# Altium schematic sheet 1_P1.schdoc.schdoc
size 431 x 309 mm; Symbol: Sheet-Symbol_A4; Device: Sheet-Symbol_A4; @Page Name: P1; @Create Date: 2023-09-14; @Page Count: 1; @Page No: 1; @Project Name: iFOC-Demo; @Schematic Name: Schematic1; @Update Date: 2023-09-19; Company: Matrixchung; Page Size: A4; Version: V1.0
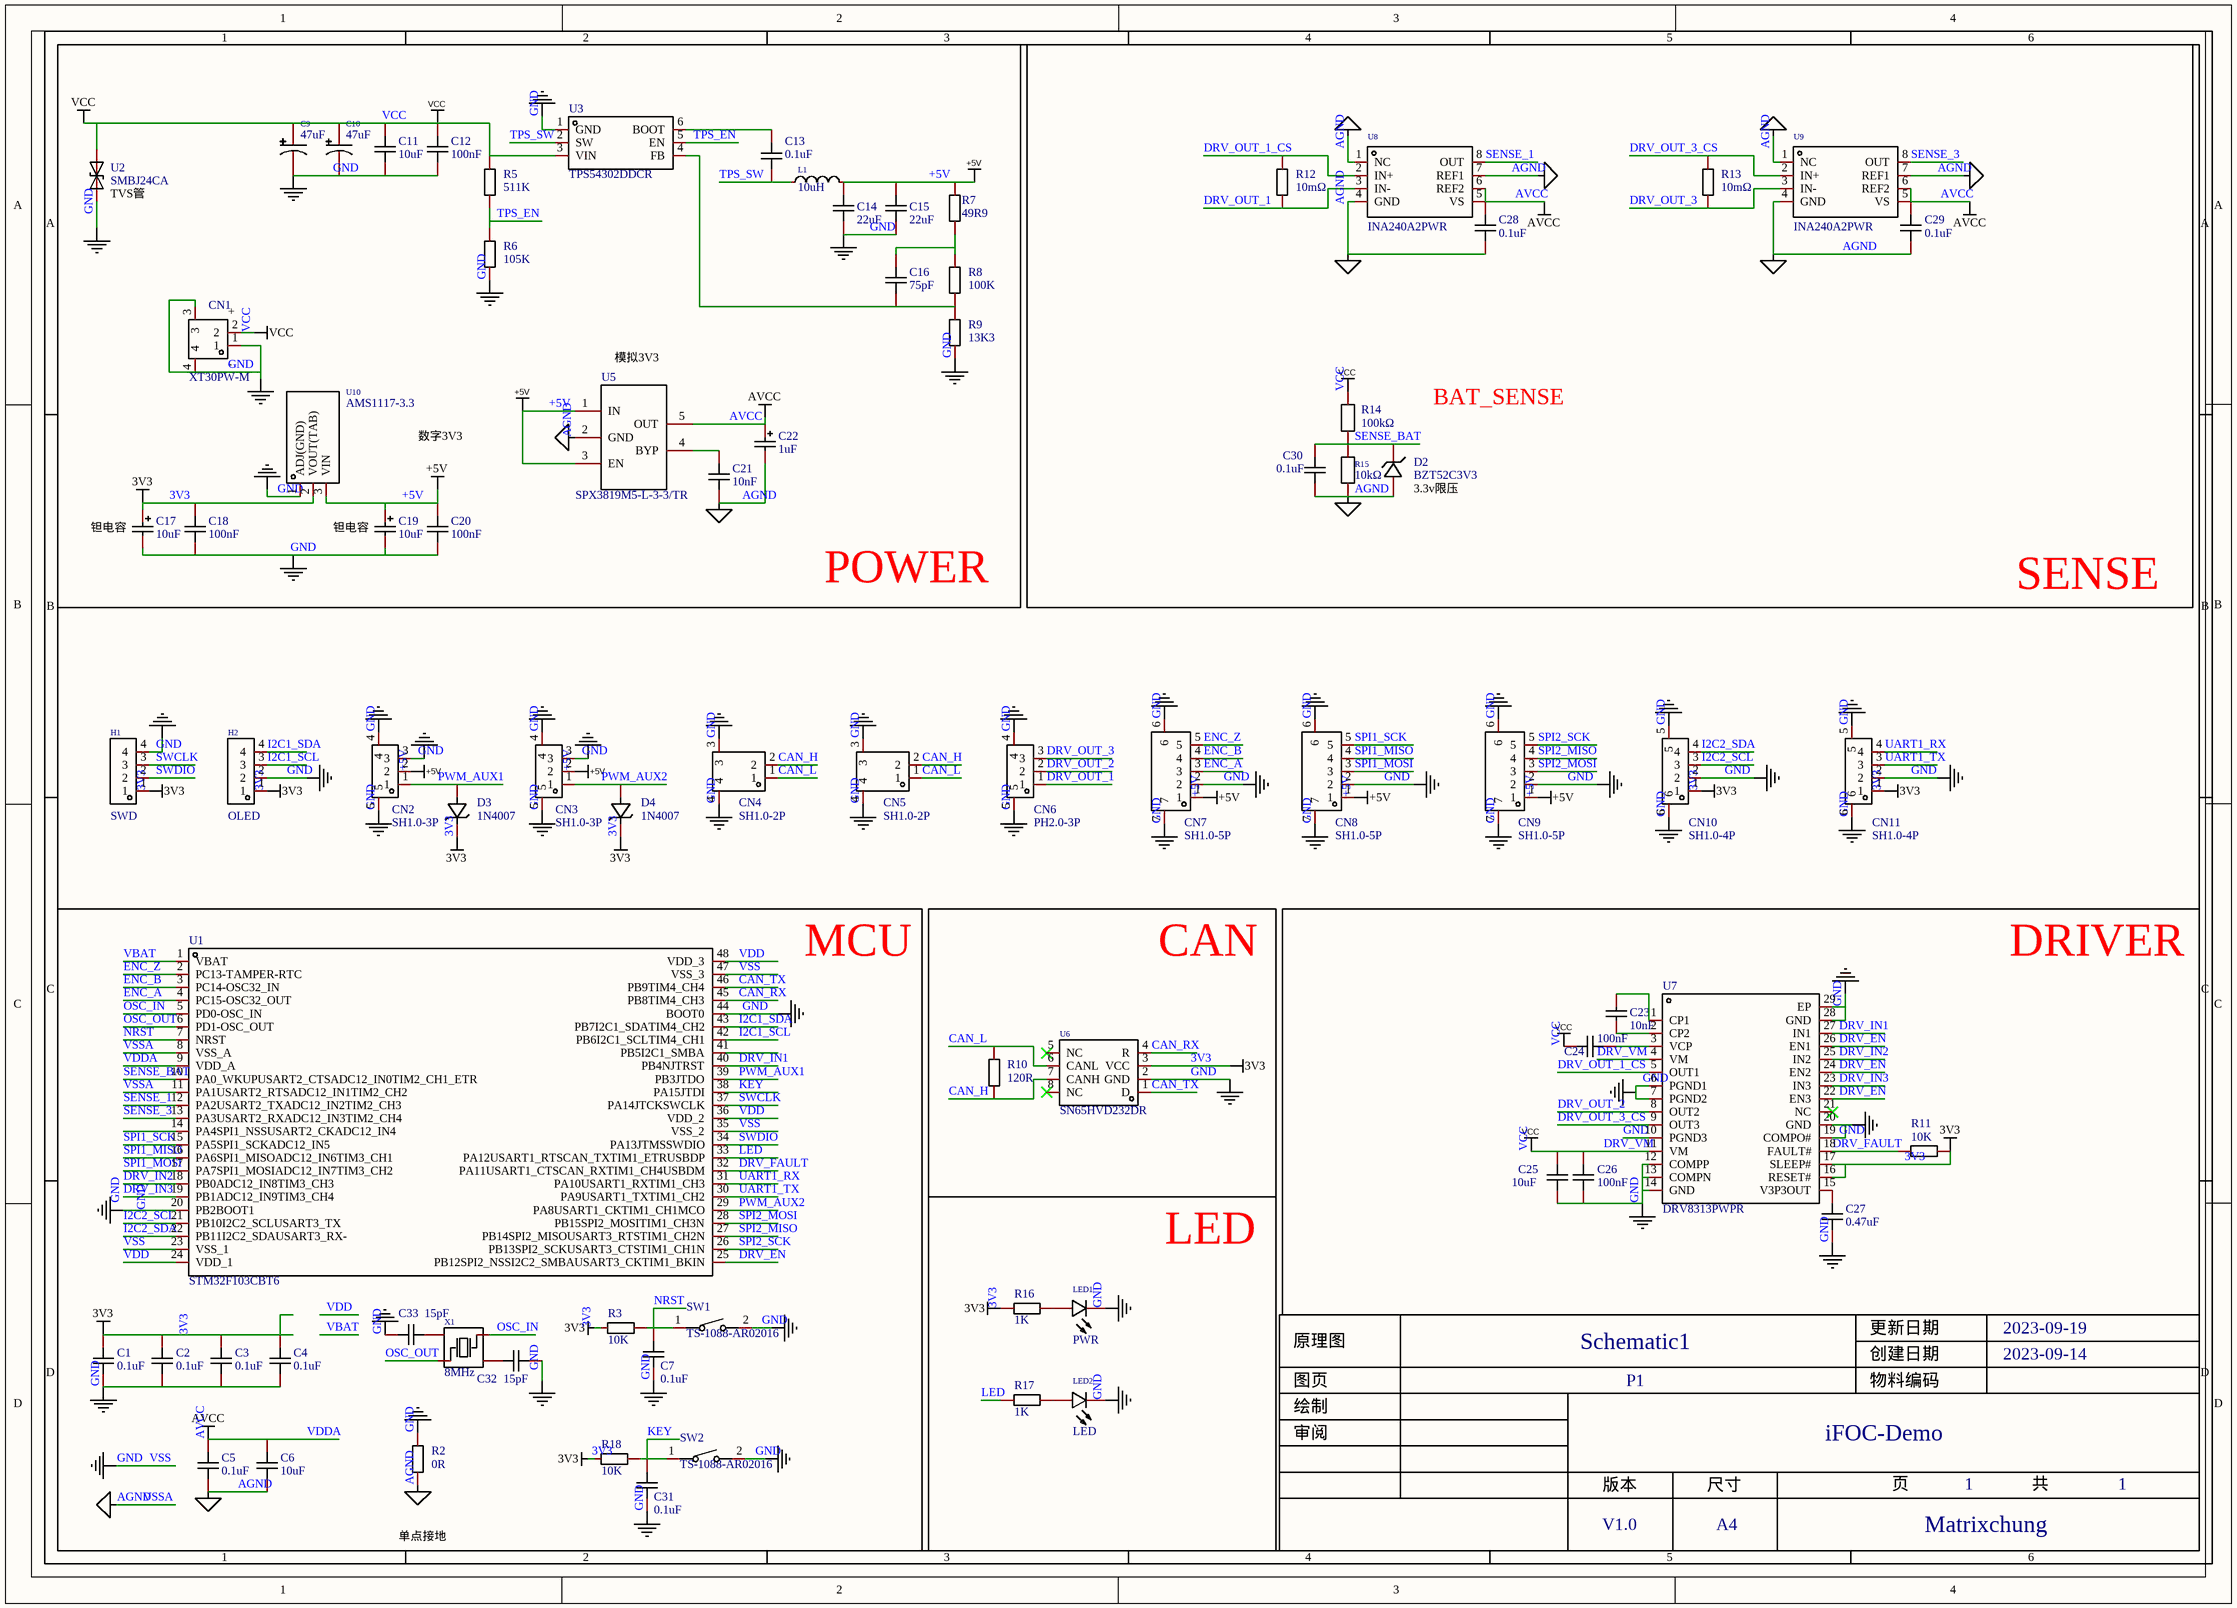
[diagram p0: 1_P1.schdoc.schdoc]

## Parts
C1  0.1uF  [C0603]
C2  0.1uF  [C0603]
C3  0.1uF  [C0603]
C4  0.1uF  [C0603]
C5  0.1uF  [C0603]
C6  10uF  [C0603]
C7  0.1uF  [C0603]
C9  47uF  [CAP-SMD_BD6.3-L6.6-W6.6-LS7.6-FD]
C10  47uF  [CAP-SMD_BD6.3-L6.6-W6.6-LS7.6-FD]
C11  10uF  [C0603]
C12  100nF  [C0603]
C13  0.1uF  [C0603]
C14  22uF  [C0603]
C15  22uF  [C0603]
C16  75pF  [C0603]
C17  10uF  [CASE-A_3216]
C18  100nF  [C0603]
C19  10uF  [CASE-A_3216]
C20  100nF  [C0603]
C21  10nF  [C0603]
C22  1uF  [CASE-A_3216]
C23  10nF  [C0603]
C24  100nF  [C0603]
C25  10uF  [C0603]
C26  100nF  [C0603]
C27  0.47uF  [C0603]
C28  0.1uF  [C0603]
C29  0.1uF  [C0603]
C30  0.1uF  [C0603]
C31  0.1uF  [C0603]
C32  15pF  [C0603]
C33  15pF  [C0603]
CN1  XT30PW-M  [CONN-TH_XT30PW-M]
CN2  SH1.0-3P  [CONN-SMD_3P-P1.00_HDGC_HDGC1002WR-S-3P]
CN3  SH1.0-3P  [CONN-SMD_3P-P1.00_HDGC_HDGC1002WR-S-3P]
CN4  SH1.0-2P  [CONN-SMD_A1002WR-S-2P]
CN5  SH1.0-2P  [CONN-SMD_A1002WR-S-2P]
CN6  PH2.0-3P  [CONN-SMD_3P-P2.00_ZX-PH2.0-WT3P]
CN7  SH1.0-5P  [CONN-SMD_5P-P1.00_SHOU-HAN_1.0-5P-WT]
CN8  SH1.0-5P  [CONN-SMD_5P-P1.00_SHOU-HAN_1.0-5P-WT]
CN9  SH1.0-5P  [CONN-SMD_5P-P1.00_SHOU-HAN_1.0-5P-WT]
CN10  SH1.0-4P  [CONN-SMD_4P-P1.00_HDGC_HDGC1002WR-S-4P]
CN11  SH1.0-4P  [CONN-SMD_4P-P1.00_HDGC_HDGC1002WR-S-4P]
D2  BZT52C3V3  [SOD-123_L2.7-W1.6-LS3.7-RD]
D3  1N4007  [SOD-123FL_L2.7-W1.8-LS3.8-RD]
D4  1N4007  [SOD-123FL_L2.7-W1.8-LS3.8-RD]
H1  SWD  [HDR-TH_4P-P2.54-V-F]
H2  OLED  [HDR-TH_4P-P2.54-V-F]
L1  10uH  [IND-SMD_L5.4-W5.2_FXL0530]
LED1  PWR  [LED0603-RD]
LED2  LED  [LED0603-RD_RED]
R2  0R  [R0603]
R3  10K  [R0603]
R5  511K  [R0603]
R6  105K  [R0603]
R7  49R9  [R0603]
R8  100K  [R0603]
R9  13K3  [R0603]
R10  120R  [R0603]
R11  10K  [R0603]
R12  10mΩ  [R0805]
R13  10mΩ  [R0805]
R14  100kΩ  [R0805]
R15  10kΩ  [R0603]
R16  1K  [R0603]
R17  1K  [R0603]
R18  10K  [R0603]
SW1  TS-1088-AR02016  [SW-SMD_L3.9-W3.0-P4.45]
SW2  TS-1088-AR02016  [SW-SMD_L3.9-W3.0-P4.45]
U1  STM32F103CBT6  [LQFP-48_L7.0-W7.0-P0.50-LS9.0-BL]
U2  SMBJ24CA  [SMB_L4.3-W3.6-LS5.4-BI]
U3  TPS54302DDCR  [SOT-23-6_L2.9-W1.6-P0.95-LS2.8-BL]
U5  SPX3819M5-L-3-3/TR  [SOT-23-5_L3.0-W1.7-P0.95-LS2.8-BL]
U6  SN65HVD232DR  [SOIC-8_L5.0-W4.0-P1.27-LS6.0-BL]
U7  DRV8313PWPR  [HTSSOP-28_L9.8-W4.5-P0.65-LS6.6-BL-EP]
U8  INA240A2PWR  [TSSOP-8_L4.4-W3.0-P0.65-LS6.4-BL]
U9  INA240A2PWR  [TSSOP-8_L4.4-W3.0-P0.65-LS6.4-BL]
U10  AMS1117-3.3  [SOT-89_L4.5-W2.5-P1.50-LS4.2-BR]
X1  8MHz  [OSC-SMD_4P-L3.2-W2.5-BL]

## Blocks framed on the sheet
POWER: C9-C22 CN1 L1 R5-R9 U2 U3 U5 U10
SENSE: C28-C30 D2 R12-R15 U8 U9
MCU: C1-C7 C31-C33 R2 R3 R18 SW1 SW2 U1 X1
CAN: R10 U6
DRIVER: C23-C27 R11 U7
LED: LED1 LED2 R16 R17

## Nets
3V3: C1.2 C2.2 C3.2 C4.2 C17.1 C18.2 CN10.1 CN11.1 D3.1(K) D4.1(K) H1.1 H2.1 R3.1 R11.2 R16.1 R18.1 U6.3(VCC) U7.16(RESET#) U7.17(SLEEP#) U10.2(VOUT(TAB))
+5V: C14.2 C15.2 C19.1 C20.2 CN2.2 CN3.2 CN7.1 CN8.1 CN9.1 L1.2 R7.2 U5.1(IN) U5.3(EN) U10.3(VIN)
AGND: C1.1 C2.1 C3.1 C4.1 C5.1 C6.1 C7.1 C9.2 C10.2 C11.1 C12.1 C14.1 C15.1 C17.2 C18.1 C19.2 C20.1 C21.1 C22.2 C25.1 C26.1 C27.1 C28.1 C29.1 C30.1 C31.1 C32.2 C33.1 CN1.1 CN1.3 CN1.4 CN2.3 CN2.4 CN2.5 CN3.3 CN3.4 CN3.5 CN4.3 CN4.4 CN5.3 CN5.4 CN6.4 CN6.5 CN7.2 CN7.6 CN7.7 CN8.2 CN8.6 CN8.7 CN9.2 CN9.6 CN9.7 CN10.2 CN10.5 CN10.6 CN11.2 CN11.5 CN11.6 D2.2(A) H1.4 H2.2 LED1.1(-) LED2.1(K) R2.1 R2.2 R6.1 R9.1 R15.1 SW1.2 SW2.2 U1.8(VSS_A) U1.11(PA1USART2_RTSADC12_IN1TIM2_CH2) U1.20(PB2BOOT1) U1.23(VSS_1) U1.35(VSS_2) U1.44(BOOT0) U1.47(VSS_3) U2.2(A) U3.1(GND) U5.2(GND) U6.2(GND) U7.6(PGND1) U7.7(PGND2) U7.10(PGND3) U7.12(COMPP) U7.13(COMPN) U7.14(GND) U7.19(COMPO#) U7.20(GND) U7.28(GND) U7.29(EP) U8.1(NC) U8.4(GND) U8.7(REF1) U9.1(NC) U9.4(GND) U9.7(REF1) U10.1(ADJ(GND))  [also labelled GND, VSS, VSSA]
AVCC: C5.2 C6.2 C22.1 C28.2 C29.2 U1.9(VDD_A) U5.5(OUT) U8.5(VS) U8.6(REF2) U9.5(VS) U9.6(REF2)  [also labelled VDDA]
DRV_VM: C9.1 C10.1 C11.2 C12.2 C24.1 C25.2 C26.2 CN1.2 R5.2 R14.2 U2.1(K) U3.3(VIN) U7.4(VM) U7.11(VM)  [also labelled VCC]
CAN_H: CN4.2 CN5.2 R10.1 U6.7(CANH)
CAN_L: CN4.1 CN5.1 R10.2 U6.6(CANL)
CAN_RX: U1.45(PB8TIM4_CH3) U6.4(R)
CAN_TX: U1.46(PB9TIM4_CH4) U6.1(D)
DRV_EN: U1.25(PB12SPI2_NSSI2C2_SMBAUSART3_CKTIM1_BKIN) U7.22(EN3) U7.24(EN2) U7.26(EN1)
DRV_FAULT: R11.1 U1.32(PA11USART1_CTSCAN_RXTIM1_CH4USBDM) U7.18(FAULT#)
DRV_IN1: U1.40(PB4NJTRST) U7.27(IN1)
DRV_IN2: U1.18(PB0ADC12_IN8TIM3_CH3) U7.25(IN2)
DRV_IN3: U1.19(PB1ADC12_IN9TIM3_CH4) U7.23(IN3)
DRV_OUT_1: CN6.1 R12.1 U8.3(IN-)
DRV_OUT_1_CS: R12.2 U7.5(OUT1) U8.2(IN+)
DRV_OUT_2: CN6.2 U7.8(OUT2)
DRV_OUT_3: CN6.3 R13.1 U9.3(IN-)
DRV_OUT_3_CS: R13.2 U7.9(OUT3) U9.2(IN+)
ENC_A: CN7.3 U1.4(PC15-OSC32_OUT)
ENC_B: CN7.4 U1.3(PC14-OSC32_IN)
ENC_Z: CN7.5 U1.2(PC13-TAMPER-RTC)
I2C1_SCL: H2.3 U1.42(PB6I2C1_SCLTIM4_CH1)
I2C1_SDA: H2.4 U1.43(PB7I2C1_SDATIM4_CH2)
I2C2_SCL: CN10.3 U1.21(PB10I2C2_SCLUSART3_TX)
I2C2_SDA: CN10.4 U1.22(PB11I2C2_SDAUSART3_RX-)
KEY: C31.2 R18.2 SW2.1 U1.38(PA15JTDI)
LED: R17.1 U1.33(PA12USART1_RTSCAN_TXTIM1_ETRUSBDP)
NRST: C7.2 R3.2 SW1.1 U1.7(NRST)
OSC_IN: U1.5(PD0-OSC_IN) X1.3
OSC_OUT: U1.6(PD1-OSC_OUT) X1.1
PWM_AUX1: CN2.1 D3.2(A) U1.39(PB3JTDO)
PWM_AUX2: CN3.1 D4.2(A) U1.29(PA8USART1_CKTIM1_CH1MCO)
SENSE_1: U1.12(PA2USART2_TXADC12_IN2TIM2_CH3) U8.8(OUT)
SENSE_3: U1.13(PA3USART2_RXADC12_IN3TIM2_CH4) U9.8(OUT)
SENSE_BAT: C30.2 D2.1(K) R14.1 R15.2 U1.10(PA0_WKUPUSART2_CTSADC12_IN0TIM2_CH1_ETR)
SPI1_MISO: CN8.4 U1.16(PA6SPI1_MISOADC12_IN6TIM3_CH1)
SPI1_MOSI: CN8.3 U1.17(PA7SPI1_MOSIADC12_IN7TIM3_CH2)
SPI1_SCK: CN8.5 U1.15(PA5SPI1_SCKADC12_IN5)
SPI2_MISO: CN9.4 U1.27(PB14SPI2_MISOUSART3_RTSTIM1_CH2N)
SPI2_MOSI: CN9.3 U1.28(PB15SPI2_MOSITIM1_CH3N)
SPI2_SCK: CN9.5 U1.26(PB13SPI2_SCKUSART3_CTSTIM1_CH1N)
SWCLK: H1.3 U1.37(PA14JTCKSWCLK)
SWDIO: H1.2 U1.34(PA13JTMSSWDIO)
TPS_EN: R5.1 R6.2 U3.5(EN)
TPS_SW: C13.1 L1.1 U3.2(SW)
UART1_RX: CN11.4 U1.31(PA10USART1_RXTIM1_CH3)
UART1_TX: CN11.3 U1.30(PA9USART1_TXTIM1_CH2)
VBAT: U1.1(VBAT)
VDD: U1.24(VDD_1) U1.36(VDD_2) U1.48(VDD_3)
NetC13_2: C13.2 U3.6(BOOT)
NetC16_1: C16.1 R8.1 R9.2 U3.4(FB)
NetC16_2: C16.2 R7.1 R8.2
NetC21_2: C21.2 U5.4(BYP)
NetC23_1: C23.1 U7.2(CP2)
NetC23_2: C23.2 U7.1(CP1)
NetC24_2: C24.2 U7.3(VCP)
NetC27_2: C27.2 U7.15(V3P3OUT)
NetC32_1: C32.1 X1.2
NetC33_2: C33.2 X1.4
NetLED1_2: LED1.2(+) R16.2
NetLED2_2: LED2.2(A) R17.2

Not connected (* = marked no-connect by the designer): U1 14(PA4SPI1_NSSUSART2_CKADC12_IN4) 41(PB5I2C1_SMBA); U6 5(NC)* 8(NC)*; U7 21(NC)*

## Notes on the sheet
- (near U2) TVS管
- (near CN1) +
- (near CN1) -
- (near U5) 模拟3V3
- 数字3V3
- BAT_SENSE
- (near D2) 3.3v限压
- (near C17) 钽电容
- 钽电容
- 单点接地
- Labels drawn without touching a wire or pin: GND
- 1
- 2
- 3
- 4
- 5
- 6
- A
- B
- C
- D
- 原理图
- Schematic1
- 创建日期
- 更新日期
- 2023-09-14
- 2023-09-19
- 审阅
- 绘制
- 图页
- P1
- 物料编码
- iFOC-Demo
- 版本
- 尺寸
- 页
- 共
- V1.0
- A4
- Matrixchung

## Library data of the parts
C1-C7 C11-C16 C18 C20 C21 C24-C33 = CAP_0603: Symbol: CapAcitance; Convert to PCB: yes; Device: CAP_0603; Add into BOM: yes; Supplier Footprint: 0603
  C1-C5 C7 C13 C28-C31: Name: 0.1uF; Value: 0.1uF
  C6 C11 C25: Name: 10uF; Value: 10uF
  C12 C18 C20 C24 C26: Name: 100nF; Value: 100nF
  C14 C15: Name: 22uF; Value: 22uF
  C16: Name: 75pF; Value: 75pF
  C21: Name: 10nF; Value: 10nF
  C27: Name: 0.47uF; Value: 0.47uF
  C32 C33: Name: 15pF; Value: 15pF
C9 C10 = VT1V470M0605: 容值:47uF;精度:±20%;额定电压:35V;纹波电流:66mA@120Hz;等效串联电阻:-;; Manufacturer: ROQANG(容强); Add into BOM: yes; Tolerance: ±20%; Rated Voltage: 35V; φD: 6.3mm; L: 5.4mm; Lifetime @ Temp: 2000hrs@105℃; Name: 47uF; Symbol: VT1V470M0605; Device: VT1V470M0605; LCSC Part Name: 47uF ±20% 35V; Supplier Part: C90276; Manufacturer Part: VT1V470M0605; Supplier Footprint: SMD,D6.3xL5.4mm; JLCPCB Part Class: 扩展库; Datasheet: https://atta.szlcsc.com/upload/public/pdf/source/20161207/1481104186053.pdf; Supplier: LCSC; Convert to PCB: yes; Value: 47uF; Ripple Current: 66mA@120Hz; Equivalent Series Resistance(ESR): -; Operating Temperature: -40℃~+105℃
C17 C19 = TAJA106K010RNJ: 容值:10uF;精度:±10%;额定电压:10V;等效串联电阻:3Ω@100kHz;; Manufacturer: Kyocera AVX; Add into BOM: yes; Tolerance: ±10%; Rated Voltage: 10V; Name: 10uF; Symbol: TAJA106K010RNJ; Device: TAJA106K010RNJ; LCSC Part Name: 10uF ±10% 10V; Supplier Part: C7177; Manufacturer Part: TAJA106K010RNJ; Supplier Footprint: CASE-A-3216; JLCPCB Part Class: 扩展库; Datasheet: https://atta.szlcsc.com/upload/public/pdf/source/20160107/1457707748330.pdf; Supplier: LCSC; Convert to PCB: yes; Value: 10uF; Equivalent Series Resistance(ESR): 3Ω@100kHz; Operating Temperature: -55℃~+125℃
C22 = TAJA105K016RNJ: 容值:1uF;精度:±10%;额定电压:16V;等效串联电阻:11Ω;; Manufacturer: Kyocera AVX; Add into BOM: yes; Tolerance: ±10%; Rated Voltage: 16V; Equivalent Series Resistance(ESR): 11Ω; Name: 1uF; Symbol: TAJA105K016RNJ; Device: TAJA105K016RNJ; LCSC Part Name: 1uF ±10% 16V; Supplier Part: C7174; Manufacturer Part: TAJA105K016RNJ; Supplier Footprint: CASE-A-3216; JLCPCB Part Class: 扩展库; Datasheet: https://atta.szlcsc.com/upload/public/pdf/source/20160107/1457707748219.pdf; Supplier: LCSC; Convert to PCB: yes; Value: 1uF; Operating Temperature: -55℃~+125℃
C23 = 0603B103K101NT: 容值:10nF;精度:±10%;额定电压:100V;材质(温度系数):X7R;; Manufacturer: FH(风华); Add into BOM: yes; Tolerance: ±10%; Voltage Rated: 100V; Temperature Coefficient: X7R; Name: 10nF; Symbol: 0603B103K101NT; Device: 0603B103K101NT; LCSC Part Name: 10nF ±10% 100V; Supplier Part: C43253; Manufacturer Part: 0603B103K101NT; Supplier Footprint: 0603; JLCPCB Part Class: 扩展库; Datasheet: https://atta.szlcsc.com/upload/public/pdf/source/20170923/C43253_1506149458409988771.pdf; Supplier: LCSC; Convert to PCB: yes; Value: 10nF
CN1 = XT30PW-M: Socket,DCsupply,XT30,male,PIN:2; Manufacturer: AMASS(艾迈斯); Add into BOM: yes; Name: XT30PW-M; Symbol: XT30PW-M; Device: XT30PW-M; LCSC Part Name: AMASS(艾迈斯)航模插头 卧式弯脚 XT30PW-M公头; Supplier Part: C431092; Manufacturer Part: XT30PW-M; Supplier Footprint: -; JLCPCB Part Class: 扩展库; Datasheet: https://atta.szlcsc.com/upload/public/pdf/source/20220222/6A9F22F7850E25B33E1BE430ADF8560B.pdf; Supplier: LCSC; Convert to PCB: yes
CN2 CN3 = HDGC1002WR-S-3P: SH1.0针座卧贴 3P; Manufacturer: HDGC(华德共创); Add into BOM: yes; Name: SH1.0-3P; Symbol: HDGC1002WR-S-3P; Device: HDGC1002WR-S-3P; LCSC Part Name: SH1.0针座卧贴 3P; Supplier Part: C2936213; Manufacturer Part: SH1.0-3P; Supplier Footprint: SMD,P=1mm; JLCPCB Part Class: Extended Part; Datasheet: https://atta.szlcsc.com/upload/public/pdf/source/20211229/E8A09E85670B5E97244D2008A24D97FE.pdf; Supplier: LCSC; Convert to PCB: yes
CN4 CN5 = A1002WR-S-2P: 系列:SH;连接器类型:接头;触头类型:公形引脚;间距:0.039"(1.00mm);针脚数:2;; Manufacturer: CJT(长江连接器); Add into BOM: yes; Connector Type: 接头; Number of Positions: 2; Name: SH1.0-2P; Symbol: A1002WR-S-2P; Device: A1002WR-S-2P; LCSC Part Name: 2P,脚距1mm; Supplier Part: C239520; Manufacturer Part: SH1.0-2P; Supplier Footprint: SMD,P=1mm; JLCPCB Part Class: 扩展库; Datasheet: https://atta.szlcsc.com/upload/public/pdf/watermark/20190926/C239520_20E9BDF14633EA92CE6C693DF62606DD.pdf; Supplier: LCSC; Convert to PCB: yes; Series: SH; Contact Type: 公形引脚; Pitch: 0.039"(1.00mm); Number of Rows: 1; Row Spacing: -; Mounting Type: 表面贴装，直角; Contact Material: 磷青铜
CN6 = ZX-PH2.0-WT3P: 参考系列:PH;间距:2mm;插针结构:1x3P;排数:1;每排PIN数:3;行距:-;公母:公型插针;安装方式:卧贴;额定电流:2A;触头材质:黄铜;触头镀层:锡;工作温度范围:-25℃~+85℃;焊接温度(最大值):260℃;; Manufacturer: Megastar(兆星); Add into BOM: yes; Reference Series: PH; Pitch: 2mm; Pins Structure: 1x3P; Number of PINs Per Row: 3; Gender: 公型插针; Current Rating (Max): 2A; Welding Temperature (Max): 260℃; Name: PH2.0-3P; Symbol: ZX-PH2.0-WT3P; Device: ZX-PH2.0-WT3P; LCSC Part Name: PH 2mm 1x3P 卧贴; Supplier Part: C7429690; Manufacturer Part: PH2.0-3P; Supplier Footprint: SMD,P=2.0mm; JLCPCB Part Class: 扩展库; Datasheet: https://atta.szlcsc.com/upload/public/pdf/source/20230619/9717BB42C9B05E1576CFD3C6FD52A230.pdf; Supplier: LCSC; Convert to PCB: yes; Number of Rows: 1; Row Spacing: -; Mounting Style: 卧贴; Contact Material: 黄铜; Contact Plating: 锡; Operating Temperature Range: -25℃~+85℃; link: https://atta.szlcsc.com/upload/public/pdf/source/20230619/9717BB42C9B05E1576CFD3C6FD52A230.pdf
CN7-CN9 = 1.0-5P WT: 1.0mm卧式 贴片针座 5Pin 1.0-5P WT 180度; Manufacturer: SHOU HAN(首韩); Add into BOM: yes; Name: SH1.0-5P; Symbol: 1.0-5P WT; Device: 1.0-5P WT; LCSC Part Name: 针座连接器 卧贴 5P 间距1mm; Supplier Part: C2906271; Manufacturer Part: SH1.0-5P; Supplier Footprint: SMD,P=1mm; JLCPCB Part Class: 扩展库; Datasheet: https://atta.szlcsc.com/upload/public/pdf/source/20211019/F6C8BB00F705446EDA229495354B330C.pdf; Supplier: LCSC; Convert to PCB: yes
CN10 CN11 = HDGC1002WR-S-4P: SH1.0针座卧贴 4P; Manufacturer: HDGC(华德共创); Add into BOM: yes; Name: SH1.0-4P; Symbol: HDGC1002WR-S-4P; Device: HDGC1002WR-S-4P; LCSC Part Name: SH1.0针座卧贴 4P; Supplier Part: C2936214; Manufacturer Part: SH1.0-4P; Supplier Footprint: SMD,P=1mm; JLCPCB Part Class: Extended Part; Datasheet: https://atta.szlcsc.com/upload/public/pdf/source/20211229/E8A09E85670B5E97244D2008A24D97FE.pdf; Supplier: LCSC; Convert to PCB: yes
D2 = BZT52C3V3_C173413: 二极管配置:独立式;稳压值(标称值):3.3V;稳压值(范围):3.1V~3.5V;精度:-;功率:500mW;; Manufacturer: MDD; Add into BOM: yes; Diode Configuration: 独立式; Zener Voltage (Nom): 3.3V; Power Dissipation: 500mW; Reverse Leakage Current (Ir): 5uA@1V; Zener Impedance (Zzt): 95Ω; Name: BZT52C3V3; Symbol: BZT52C3V3; Device: BZT52C3V3_C173413; LCSC Part Name: 500mW 3.3V 稳压二极管 5%; Supplier Part: C173413; Manufacturer Part: BZT52C3V3; Supplier Footprint: SOD-123; JLCPCB Part Class: Extended Part; Datasheet: https://atta.szlcsc.com/upload/public/pdf/source/20190118/C364303_B79676A2F6BCDB14D56544F3D9B288EE.pdf; Supplier: LCSC; Convert to PCB: yes; Zener Voltage (Range): 3.1V~3.5V; Tolerance: -
D3 D4 = 1N4007_C727082: 二极管配置:独立式;直流反向耐压(Vr):1kV;平均整流电流(Io):1A;正向压降(Vf):1.1V@1A;反向电流(Ir):10uA@1kV;; Manufacturer: TWGMC(台湾迪嘉); Add into BOM: yes; Diode Configuration: 独立式; Reverse Voltage (Vr): 1kV; Average Rectified Current (Io): 1A; Name: 1N4007; Symbol: 1N4007_C727082; Device: 1N4007_C727082; LCSC Part Name: 1kV 1A 1.1V@1A; Supplier Part: C727082; Manufacturer Part: 1N4007; Supplier Footprint: SOD-123FL; JLCPCB Part Class: 扩展库; Datasheet: https://atta.szlcsc.com/upload/public/pdf/source/20200828/C727082_2F914037E829F0E2238583225D7ED281.pdf; Supplier: LCSC; Convert to PCB: yes; Forward Voltage (Vf@If): 1.1V@1A; Reverse Leakage Current: 10uA@1kV
H1 H2 = PM254V-11-04-H85: 排数:单排;总孔位数:4;间距:2.54mm;插孔结构:1x4P;行距:-;安装类型:直插;塑高:-;触头材质:黄铜;触头镀层:-;; Manufacturer: XFCN(兴飞); Add into BOM: yes; Number of Holes: 4; Pitch: 2.54mm; Holes Structure: 1x4P; Symbol: PM254V-11-04-H85; Device: PM254V-11-04-H85; LCSC Part Name: 2.54mm 1x4P; Supplier Part: C541851; Supplier Footprint: 直插,P=2.54mm; JLCPCB Part Class: 扩展库; Supplier: LCSC; Convert to PCB: yes; Number of Rows: 单排; Row Spacing: -; Mounting Type: 直插; Insulation Height: -; Contact Material: 黄铜; Contact Plating: -
  H1: Name: SWD; Manufacturer Part: SWD
  H2: Name: OLED; Manufacturer Part: OLED
L1 = FXL0530-100-M: 电感值:10uH;精度:±20%;额定电流:3.2A;饱和电流(Isat):3.5A;; Manufacturer: cjiang(长江微电); Add into BOM: yes; Tolerance: ±20%; Rated Current: 3.2A; Saturation Current (Isat): 3.5A; DC Resistance (DCR): 110mΩ; Name: 10uH; Symbol: FXL0530-100-M; Device: FXL0530-100-M; LCSC Part Name: 10uH ±20% 3.2A 110mΩ; Supplier Part: C177248; Manufacturer Part: FXL0530-100-M; Supplier Footprint: SMD,5.4x5.2x2.8mm; JLCPCB Part Class: 扩展库; Supplier: LCSC; Convert to PCB: yes; Value: 10uH
LED1 = NCD0603B1: 发光颜色:蓝灯;; Manufacturer: 国星光电; Symbol: FC-DA1608BK-470H10; Add into BOM: yes; Emitted Color: 蓝灯; Name: PWR; Device: NCD0603B1; LCSC Part Name: 蓝灯; Supplier Part: C84266; Manufacturer Part: PWR; Supplier Footprint: 0603; JLCPCB Part Class: 扩展库; Datasheet: https://atta.szlcsc.com/upload/public/pdf/source/20200820/C84266_6A3CDBEFA72C6CAD68EDA53474ADAE6C.pdf; Supplier: LCSC; Convert to PCB: yes
LED2 = NCD0603R1_C84263: 发光颜色:红灯;; Manufacturer: 国星光电; Symbol: FC-DA1608HRK-620D; Add into BOM: yes; Emitted Color: 红灯; Name: LED; Device: NCD0603R1_C84263; LCSC Part Name: 红灯 0603红灯   正贴; Supplier Part: C84263; Manufacturer Part: LED; Supplier Footprint: 0603; JLCPCB Part Class: 扩展库; Datasheet: https://atta.szlcsc.com/upload/public/pdf/source/20200820/C84263_DABC6A75E58F576973B407FDBA283D60.pdf; Supplier: LCSC; Convert to PCB: yes
R2 R3 R5-R11 R16-R18 = Res_0603: Symbol: 电阻; Convert to PCB: yes; Device: Res_0603; Add into BOM: yes; Supplier Footprint: 0603
  R2: Name: 0R; Value: 0R
  R3 R11 R18: Name: 10K; Value: 10K
  R5: Name: 511K; Value: 511K
  R6: Name: 105K; Value: 105K
  R7: Name: 49R9; Value: 49R9
  R8: Name: 100K; Value: 100K
  R9: Name: 13K3; Value: 13K3
  R10: Name: 120R; Value: 120R
  R16 R17: Name: 1K; Value: 1K
R12 R13 = 0805W4F100MT5E: 阻值:10mΩ;精度:±1%;功率:250mW;; Manufacturer: UNI-ROYAL(厚声); Add into BOM: yes; Tolerance: ±1%; Power(Watts): 250mW; Temperature Coefficient: ±800ppm/℃; Name: 10mΩ; Symbol: 0805W4F100MT5E; Device: 0805W4F100MT5E; LCSC Part Name: 10mΩ ±1% 250mW; Supplier Part: C270927; Manufacturer Part: 0805W4F100MT5E; Supplier Footprint: 0805; JLCPCB Part Class: Extended Part; Datasheet: https://atta.szlcsc.com/upload/public/pdf/source/20180910/C270927_45D9039DD2227BF149EC6B00ED8DA171.pdf; Supplier: LCSC; Convert to PCB: yes; Value: 10mΩ
R14 = HoLTT0805-1/8W-100K-5%: 阻值:100kΩ;功率:125mW;; Manufacturer: Milliohm(毫欧); Add into BOM: yes; Power(Watts): 125mW; Name: 100kΩ; Symbol: HOLTT0805-1/8W-100K-5%; Device: HoLTT0805-1/8W-100K-5%; LCSC Part Name: 100kΩ 125mW; Supplier Part: C2904540; Manufacturer Part: HoLTT0805-1/8W-100K-5%; Supplier Footprint: 0805; JLCPCB Part Class: Extended Part; Datasheet: https://atta.szlcsc.com/upload/public/pdf/source/20211021/528351F376078D6228C985A842C3763C.pdf; Supplier: LCSC; Convert to PCB: yes; Value: 100kΩ
R15 = HoLTT0603-1/10W-10K-1%: 阻值:10kΩ;功率:100mW;; Manufacturer: Milliohm(毫欧); Add into BOM: yes; Power(Watts): 100mW; Name: 10kΩ; Symbol: HOLTT0603-1/10W-10K-1%; Device: HoLTT0603-1/10W-10K-1%; LCSC Part Name: 10kΩ 100mW; Supplier Part: C2904526; Manufacturer Part: HoLTT0603-1/10W-10K-1%; Supplier Footprint: 0603; JLCPCB Part Class: Extended Part; Datasheet: https://atta.szlcsc.com/upload/public/pdf/source/20211021/528351F376078D6228C985A842C3763C.pdf; Supplier: LCSC; Convert to PCB: yes; Value: 10kΩ
SW1 SW2 = TS-1088-AR02016: 触点电流:50mA;额定电压(DC):12V;绝缘电阻:100MΩ;电路结构:单刀单掷;安装方式:立贴;作用力:160gf@±50gf;机械寿命:10万次;带支架:否;; Manufacturer: XUNPU(讯普); Add into BOM: yes; Contact Current: 50mA; Voltage Rating (DC): 12V; Insulation Resistance: 100MΩ; Circuit: 单刀单掷; Actuator Style: 圆形按钮; Actuator/Cap Color: 黑色; Mechanical Life: 10万次; Pin Style: SMD接片; Switch Length: 4mm; Switch Width: 3mm; Switch Height: 2mm; Strike Gundam: 否; Name: TS-1088-AR02016; Symbol: TS-1088-AR02016; Device: TS-1088-AR02016; LCSC Part Name: 4*3*2mm 立贴 轻触开关; Supplier Part: C720477; Manufacturer Part: TS-1088-AR02016; Supplier Footprint: SMD; JLCPCB Part Class: 扩展库; Datasheet: https://atta.szlcsc.com/upload/public/pdf/source/20200810/C720475_60D09DD6C54279ADDB2DC25100F1CC11.pdf; Supplier: LCSC; Convert to PCB: yes; Mounting Style: 立贴; Operating Force: 160gf@±50gf; Operating Temperature: -30℃~+80℃
U1 = STM32F103CBT6: CPU内核:ARM Cortex-M3;CPU最大主频:72MHz;程序存储容量:128KB;程序存储器类型:FLASH;RAM总容量:20KB;GPIO端口数量:37;; Manufacturer: ST(意法半导体); Add into BOM: yes; CPU Maximum Speed: 72MHz; Operating Voltage Range: 2V~3.6V; Program Storage Size: 128KB; Program Memory Type: FLASH; RAM Size: 20KB; GPIO Ports Number: 37; ADC (Bit): 12bit; Universal Serial Bus: 有; Peripheral/Function: DMA；片载温度传感器；PWM; Name: STM32F103CBT6; Symbol: STM32F103CBT6; Device: STM32F103CBT6; LCSC Part Name: ARM Cortex-M3 72MHz; Supplier Part: C8304; Manufacturer Part: STM32F103CBT6; Supplier Footprint: LQFP-48(7x7); JLCPCB Part Class: 扩展库; Datasheet: https://atta.szlcsc.com/upload/public/pdf/source/20140724/1457707170379.pdf; Supplier: LCSC; Convert to PCB: yes; CPU Core: ARM Cortex-M3; EEPROM: -; DAC (Bit): -; PWM (Bit): -; Internal Comparator: -; communication protocol: -; Watchdog: 有; Real-Time Clock: -; Infrared Data Association: 有; Low-Voltage Detect: 有; CCP Capture/Compare: -; Secure Digital Input and Output: -; Direct Memory Access: 有; Internal Oscillator: 有; Operating Temperature Range: -40℃~+85℃
U2 = SMBJ24CA_C3001981: 反向截止电压(Vrwm):24V;击穿电压:26.7V;最大钳位电压:38.9V;; Manufacturer: UMW(广东友台半导体); Add into BOM: yes; Reverse Stand-Off Voltage (Vrwm): 24V; Breakdown Voltage: 26.7V; Reverse Leakage Current (Ir): 1uA; Peak Pulse Current (Ipp)@10/1000μs: 15.4A; Maximum Clamping Voltage: 38.9V; Peak Pulse Power Dissipation (Ppp)@10/1000μs: 600W; Name: SMBJ24CA; Symbol: SMBJ24CA_C3001981; Device: SMBJ24CA_C3001981; LCSC Part Name: SMBJ24CA; Supplier Part: C3001981; Manufacturer Part: SMBJ24CA; Supplier Footprint: SMB; JLCPCB Part Class: 扩展库; Datasheet: https://atta.szlcsc.com/upload/public/pdf/source/20220418/D9FB3D05D77D4AFC56F08F3CE6A64FF9.pdf; Supplier: LCSC; Convert to PCB: yes
U3 = TPS54302DDCR: 功能类型:降压型;输出类型:可调;输入电压:4.5V~28V;输出电压:596mV~28V;输出电流(最大值):3A;; Manufacturer: TI(德州仪器); Symbol: TPS54302DDCR_C311983; Add into BOM: yes; Function: 降压型; Synchronous Rectification: 是; Output Type: 可调; Number of Outputs: 1; Topology: 降压式; Output Current (Max): 3A; Switching Frequency: 400kHz; Name: TPS54302DDCR; Device: TPS54302DDCR; LCSC Part Name: 降压型 输入4.5V~28V 输出596mV~28V 3A; Supplier Part: C311983; Manufacturer Part: TPS54302DDCR; Supplier Footprint: TSOT-23-6; JLCPCB Part Class: 扩展库; Datasheet: https://atta.szlcsc.com/upload/public/pdf/source/20181023/C311983_0948EE70BFAD2011B492BD3F4CEA709D.pdf; Supplier: LCSC; Convert to PCB: yes; Input Voltage: 4.5V~28V; Output Voltage: 596mV~28V; Operating Temperature: -40℃~+125℃@(TJ)
U5 = SPX3819M5-L-3-3/TR: 输出类型:固定;输出极性:正;最大输入电压:16V;输出电压:3.3V;输出电流:500mA;电源纹波抑制比(PSRR):70dB;; Manufacturer: MaxLinear; Add into BOM: yes; Output Type: 固定; Output Polarity: 正; Number of Outputs: 1; Maximum Input Voltage: 16V; Output Voltage: 3.3V; Dropout Voltage: 700mV@(500mA); Output Current: 500mA; Power Supply Rejection Ratio (PSRR): 70dB; Name: SPX3819M5-L-3-3/TR; Symbol: SPX3819M5-L-3-3/TR; Device: SPX3819M5-L-3-3/TR; LCSC Part Name: SPX3819M5-L-3-3/TR; Supplier Part: C9055; Manufacturer Part: SPX3819M5-L-3-3/TR; Supplier Footprint: SOT-23-5; JLCPCB Part Class: 扩展库; Datasheet: https://atta.szlcsc.com/upload/public/pdf/source/20160421/1461205045150.pdf; Supplier: LCSC; Convert to PCB: yes
U6 = SN65HVD232DR: 类型:收发器;数据速率:1Mbps;; Manufacturer: TI(德州仪器); Add into BOM: yes; Data Rate: 1Mbps; Supply Voltage: 3V~3.6V; Name: SN65HVD232DR; Symbol: SN65HVD232DR; Device: SN65HVD232DR; LCSC Part Name: SN65HVD232DR; Supplier Part: C30530; Manufacturer Part: SN65HVD232DR; Supplier Footprint: SOIC-8; JLCPCB Part Class: 扩展库; Datasheet: https://atta.szlcsc.com/upload/public/pdf/source/20140507/1457707053094.pdf; Supplier: LCSC; Convert to PCB: yes; Type: 收发器
U7 = DRV8313PWPR: 类型:无刷直流BLDC;电源电压:8V~60V;输出电流:-;接口:并行;; Manufacturer: TI(德州仪器); Add into BOM: yes; Supply Voltage: 8V~60V; Interface: 并行; Name: DRV8313PWPR; Symbol: DRV8313PWPR; Device: DRV8313PWPR; LCSC Part Name: DRV8313PWPR; Supplier Part: C92482; Manufacturer Part: DRV8313PWPR; Supplier Footprint: HTSSOP-28-EP-4.5mm; JLCPCB Part Class: 扩展库; Datasheet: https://atta.szlcsc.com/upload/public/pdf/source/20180307/C92482_15204091381071407760.pdf; Supplier: LCSC; Convert to PCB: yes; Type: 无刷直流BLDC; Output Current: -; Operating Temperature: -40℃~+150℃@(Tj)
U8 U9 = INA240A2PWR: 通道数:1;; Manufacturer: TI(德州仪器); Add into BOM: yes; Number of Channels: 1; Supply Current: 1.8mA; Name: INA240A2PWR; Symbol: INA240A2PWR; Device: INA240A2PWR; LCSC Part Name: INA240A2PWR; Supplier Part: C129949; Manufacturer Part: INA240A2PWR; Supplier Footprint: TSSOP-8; JLCPCB Part Class: 扩展库; Datasheet: https://www.ti.com/cn/lit/gpn/ina240; Supplier: LCSC; Convert to PCB: yes; Operating Temperature: -40℃~+125℃
U10 = AMS1117-3.3_C347256: 输出类型:固定;输出极性:正;最大输入电压:18V;输出电压:3.3V;输出电流:1A;电源纹波抑制比(PSRR):60dB@(120Hz);; Manufacturer: UMW(友台半导体); Add into BOM: yes; Output Type: 固定; Output Polarity: 正; Number of Outputs: 1; Maximum Input Voltage: 18V; Output Voltage: 3.3V; Dropout Voltage: 1.3V@(1A); Output Current: 1A; Name: AMS1117-3.3; Symbol: AMS1117-3.3_C347256; Device: AMS1117-3.3_C347256; LCSC Part Name: 输入18V 输出3.3V 1A; Supplier Part: C347256; Manufacturer Part: AMS1117-3.3; Supplier Footprint: SOT-89; JLCPCB Part Class: 扩展库; Datasheet: https://atta.szlcsc.com/upload/public/pdf/source/20211011/50CC665C22E3A66C08379A4A74BDA25C.pdf; Supplier: LCSC; Convert to PCB: yes; Power Supply Rejection Ratio (PSRR): 60dB@(120Hz)
X1 = TAXM8M4RDBCCT2T: 频率:8MHz;频率公差:±10ppm;负载电容:10pF;; Manufacturer: TAE(雅晶鑫); Add into BOM: yes; Crystal Type: 贴片无源晶振; Frequency Tolerance: ±10ppm; Frequency Stability: ±15ppm; Load Capacitance: 10pF; Equivalent Series Resistance (ESR): 250Ω; Name: 8MHz; Symbol: TAXM8M4RDBCCT2T; Device: TAXM8M4RDBCCT2T; LCSC Part Name: 8MHz ±10ppm 10pF; Supplier Part: C400090; Manufacturer Part: TAXM8M4RDBCCT2T; Supplier Footprint: SMD3225-4P; JLCPCB Part Class: 扩展库; Datasheet: https://atta.szlcsc.com/upload/public/pdf/source/20190626/C400090_CF95B89E745AFE4EF2E392EF8AC009D6.pdf; Supplier: LCSC; Convert to PCB: yes; Value: 8MHz; Operating Temperature: -40℃~+85℃